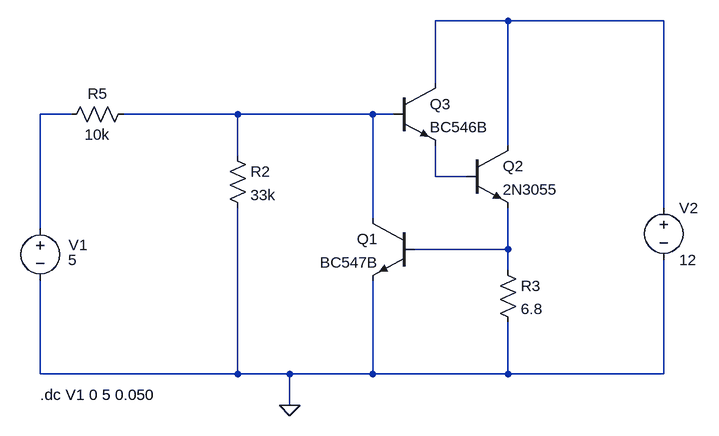
[diagram p0: schematic ambient-linear.asc]
ambient-linear.asc, the LTspice schematic file:
Version 4
SHEET 1 1524 680
WIRE 688 -240 576 -240
WIRE 928 -240 688 -240
WIRE 576 -144 576 -240
WIRE 16 -96 -32 -96
WIRE 272 -96 96 -96
WIRE 480 -96 272 -96
WIRE 512 -96 480 -96
WIRE 688 -48 688 -240
WIRE 272 -32 272 -96
WIRE 576 0 576 -48
WIRE 624 0 576 0
WIRE 928 48 928 -240
WIRE 480 64 480 -96
WIRE -32 80 -32 -96
WIRE 688 112 688 48
WIRE 688 112 544 112
WIRE 688 144 688 112
WIRE -32 304 -32 160
WIRE 272 304 272 48
WIRE 272 304 -32 304
WIRE 352 304 272 304
WIRE 480 304 480 160
WIRE 480 304 352 304
WIRE 688 304 688 224
WIRE 688 304 480 304
WIRE 928 304 928 128
WIRE 928 304 688 304
WIRE 352 352 352 304
FLAG 352 352 0
SYMBOL voltage -32 64 R0
WINDOW 3 43 64 Left 2
WINDOW 123 0 0 Left 0
WINDOW 39 0 0 Left 0
WINDOW 0 44 41 Left 2
SYMATTR Value 5
SYMATTR InstName V1
SYMBOL res 256 -48 R0
SYMATTR InstName R2
SYMATTR Value 33k
SYMBOL res 672 128 R0
SYMATTR InstName R3
SYMATTR Value 6.8
SYMBOL voltage 928 32 R0
WINDOW 123 0 0 Left 0
WINDOW 39 0 0 Left 0
SYMATTR InstName V2
SYMATTR Value 12
SYMBOL npn 544 64 M0
SYMATTR InstName Q1
SYMATTR Value BC547B
SYMBOL npn 624 -48 R0
SYMATTR InstName Q2
SYMATTR Value 2N3055
SYMBOL npn 512 -144 R0
SYMATTR InstName Q3
SYMATTR Value BC546B
SYMBOL res 112 -112 R90
WINDOW 0 0 56 VBottom 2
WINDOW 3 32 56 VTop 2
SYMATTR InstName R5
SYMATTR Value 10k
TEXT -32 336 Left 2 !.dc V1 0 5 0.050

The netlist it stands for:
* ambient-linear.asc
V1 N002 0 5
R2 N003 0 33k
R3 N005 0 6.8
V2 N001 0 12
Q1 N003 N005 0 0 BC547B
Q2 N001 N004 N005 0 2N3055
Q3 N001 N003 N004 0 BC546B
R5 N003 N002 10k
.model NPN NPN
.model PNP PNP
.lib standard.bjt
.dc V1 0 5 0.050
.backanno
.end